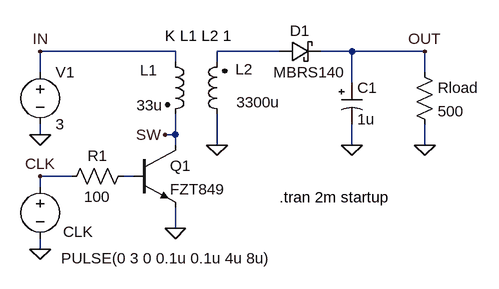
[diagram p0: schematic FlyBack.asc]
FlyBack.asc, the LTspice schematic file:
Version 4
SHEET 1 2376 1416
WIRE 1664 832 1456 832
WIRE 1824 832 1728 832
WIRE 1936 832 1888 832
WIRE 2048 832 1936 832
WIRE 1664 848 1664 832
WIRE 1728 848 1728 832
WIRE 1456 864 1456 832
WIRE 2048 864 2048 832
WIRE 1936 880 1936 832
WIRE 1456 960 1456 944
WIRE 1664 960 1664 928
WIRE 1664 960 1648 960
WIRE 1664 976 1664 960
WIRE 1728 976 1728 928
WIRE 1936 976 1936 944
WIRE 2048 976 2048 944
WIRE 1504 1024 1456 1024
WIRE 1600 1024 1584 1024
WIRE 1456 1040 1456 1024
WIRE 1664 1104 1664 1072
WIRE 1456 1136 1456 1120
FLAG 2048 832 OUT
FLAG 1936 976 0
FLAG 2048 976 0
FLAG 1456 960 0
FLAG 1664 1104 0
FLAG 1456 832 IN
FLAG 1456 1136 0
FLAG 1456 1024 CLK
FLAG 1728 976 0
FLAG 1648 960 SW
SYMBOL VOLTAGE 1456 848 R0
WINDOW 123 0 0 Left 0
SYMATTR InstName V1
SYMATTR Value 3
SYMATTR SpiceLine Rser=0.1
SYMBOL POLCAP 1920 880 R0
SYMATTR InstName C1
SYMATTR Value 1u
SYMATTR SpiceLine Rser=0.02
SYMBOL schottky 1824 848 R270
WINDOW 0 32 32 VTop 0
WINDOW 3 0 46 VBottom 0
SYMATTR InstName D1
SYMATTR Value MBRS140
SYMBOL ind2 1648 832 R0
WINDOW 0 -38 29 Left 0
WINDOW 3 -44 83 Left 0
SYMATTR InstName L1
SYMATTR Value 33u
SYMATTR SpiceLine Rser=0.02 Rpar=5000
SYMATTR Type ind
SYMBOL res 2032 848 R0
SYMATTR InstName Rload
SYMATTR Value 500
SYMBOL npn 1600 976 R0
SYMATTR InstName Q1
SYMATTR Value FZT849
SYMBOL res 1600 1008 R90
WINDOW 0 0 56 VBottom 0
WINDOW 3 32 56 VTop 0
SYMATTR InstName R1
SYMATTR Value 100
SYMBOL voltage 1456 1024 R0
WINDOW 0 35 85 Left 0
WINDOW 3 32 126 Left 0
WINDOW 123 0 0 Left 0
WINDOW 39 0 0 Left 0
SYMATTR InstName CLK
SYMATTR Value PULSE(0 3 0 0.1u 0.1u 4u 8u)
SYMBOL ind2 1744 944 R180
WINDOW 0 -40 85 Left 0
WINDOW 3 -82 34 Left 0
SYMATTR InstName L2
SYMATTR Value 3300u
SYMATTR Type ind
TEXT 1824 1056 Left 0 !.tran 2m startup
TEXT 1648 808 Left 0 !K L1 L2 1

The netlist it stands for:
* FlyBack.asc
V1 IN 0 3 Rser=0.1
C1 OUT 0 1u Rser=0.02
D1 N001 OUT MBRS140
L1 IN SW 33u Rser=0.02 Rpar=5000
Rload OUT 0 500
Q1 SW N002 0 0 FZT849
R1 N002 CLK 100
V§CLK CLK 0 PULSE(0 3 0 0.1u 0.1u 4u 8u)
L2 0 N001 3300u
.model D D
.lib standard.dio
.model NPN NPN
.model PNP PNP
.lib standard.bjt
.tran 2m startup
K L1 L2 1
.backanno
.end